# Altium schematic sheet Power.SchDoc
size A4
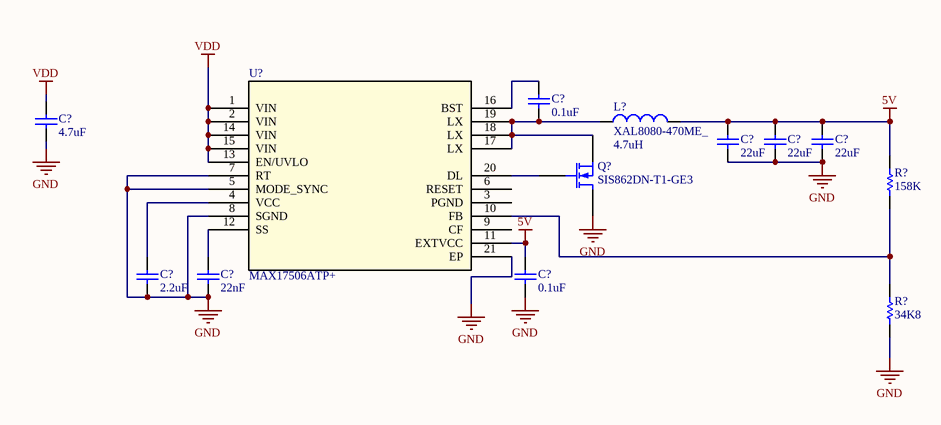
[diagram p0: Power.SchDoc]

## Parts
(Parts that share a designator on the sheet are numbered #1, #2 ... from top to bottom, then left to right.)
C?#1  value 0.1uF  [C0402[1005X55]]  (hidden comment: 0.1uF 16V 0402)
C?#2  value 4.7uF  [C1210[3225X200]]  (hidden comment: 4.7uF 100V 1210)
C?#3  value 22uF  [C1210[3225X250]]  (hidden comment: 22uF 16V 1210)
C?#4  value 22uF  [C1210[3225X250]]  (hidden comment: 22uF 16V 1210)
C?#5  value 22uF  [C1210[3225X250]]  (hidden comment: 22uF 16V 1210)
C?#6  value 2.2uF  [C0603[1608X92]]  (hidden comment: 2.2uF 10V 0603)
C?#7  value 22nF  [C0402[1005X55]]  (hidden comment: 22nF 50V 0402)
C?#8  value 0.1uF  [C0402[1005X55]]  (hidden comment: 0.1uF 6.3V 0402)
L?  XAL8080-470ME_  value 4.7uH  [XAL8080]
Q?  SIS862DN-T1-GE3  [PowerPak-1212-8]
R?#1  value 158K  [R0402[1005]]  (hidden comment: 158K 1% 0402)
R?#2  value 34K8  [R0402[1005]]  (hidden comment: 34K8 1% 0402)
U?  MAX17506ATP+  [21-0140L_T2055-4]

## Nets
5V: C?#3.2 C?#4.2 C?#5.2 C?#8.2 L?.2 R?#1.2 U?.11(EXTVCC)
GND: C?#2.1 C?#3.1 C?#4.1 C?#5.1 C?#6.1 C?#7.1 C?#8.1 Q?.3(D) R?#2.1 U?.5(MODE_SYNC) U?.7(RT) U?.8(SGND) U?.21(EP)
VDD: C?#2.2 U?.1(VIN) U?.2(VIN) U?.13(EN/UVLO) U?.14(VIN) U?.15(VIN)
NetC?#1_1: C?#1.1 L?.1 Q?.1(S) U?.17(LX) U?.18(LX) U?.19(LX)
NetC?#1_2: C?#1.2 U?.16(BST)
NetC?#6_2: C?#6.2 U?.4(VCC)
NetC?#7_2: C?#7.2 U?.12(SS)
NetQ?_2: Q?.2(G) U?.20(DL)
NetR?#1_1: R?#1.1 R?#2.2 U?.10(FB)

Not connected (* = marked no-connect by the designer): U? 3(PGND) 6(RESET) 9(CF)

## Library data of the parts
C?#1 = CAP_0.1uF_16V_0402_10%: 0.1uF 16V 10% 0402 (1005 Metric); PartNumber: GRM155R70J104KA01D; Manufacturer: Murata; Voltage: 6.3V; Mounting Technology: Surface Mount; PackageReference: 0402; PackageDescription: 0402 (1005 Metric); Tolerance: 10%
C?#2 = CAP_4.7uF_100V_1210_10%: 4.7uF 100V 10% 1210 (3225 Metric); PartNumber: GRJ32DC72A475KE11L; Manufacturer: Murata; Mounting Technology: Surface Mount; PackageReference: 1210; PackageDescription: 1210 (3225 Metric); Voltage: 100V; Tolerance: 10%
C?#3-C?#5 = CAP_22uF_16V_1210_20%_1: 22uF 16V 20% 1210 (3225 Metric); PartNumber: GRM32ER61C476ME15L; Manufacturer: Murata; Mounting Technology: Surface Mount; PackageReference: 1210; PackageDescription: 1210 (3225 Metric); Voltage: 16V; Tolerance: 20%
C?#6 = CAP_2.2uF_10V_0603_10%_1: 232uF 10V 10% 0603 (1608 Metric); PartNumber: GRT188R60J226ME13D; Manufacturer: Murata; Voltage: 6.3V; Mounting Technology: Surface Mount; PackageReference: 0603; PackageDescription: 0603 (1608 Metric); Tolerance: 10%
C?#7 = CAP_22nF_50V_0402_10%: 22nF 50V 10% 0402 (1005 Metric); PartNumber: GRM155R71H223KA12J; Manufacturer: Murata; Mounting Technology: Surface Mount; PackageReference: 0402; PackageDescription: 0402 (1005 Metric); Voltage: 50V; Tolerance: 10%
C?#8 = CAP_0.1uF_6.3V_0402_10%: 0.1uF 6.3V 10% 0402 (1005 Metric); PartNumber: GRM155R70J104KA01D; Manufacturer: Murata; Mounting Technology: Surface Mount; PackageReference: 0402; PackageDescription: 0402 (1005 Metric); Voltage: 6.3V; Tolerance: 10%
L? = XAL8080-470ME_: 4.7uH 38A 4.08mOhms; Code_IEC: 1005; Published: 8-Jun-2000; LatestRevisionDate: 29-May-2009; LatestRevisionNote: IPC-7351 Footprint Added.; PackageReference: 0402-A; Publisher: Altium Limited; PackageDescription: Chip Inductor; Code_JEITA: 0402
Q? = SIS862DN-T1-GE3: N-Channel MOSFET; Manufacturer: Vishay; PackageReference: PowerPAK-1212-8; PartNumber: SIS862DN-T1-GE3; Mounting Technology: Surface Mount
R?#1 = RES_158K_0402_1%: 158K 0.1W 1% 0402 (1005 Metric); Manufacturer: KOA Speer; PartNumber: RK73H1ETTP1502F; Power: 0.063W; Tolerance: 1%; Mounting Technology: Surface Mount; PackageReference: 0402; PackageDescription: 0402 (1005 Metric); ComponentLink1Description: Datasheet; ComponentLink1URL: http://www.koaspeer.com/catimages/Products/RK73H/RK73H.pdf
R?#2 = RES_34K8_0402_1%: 34K8 0.1W 1% 0402 (1005 Metric); Manufacturer: KOA Speer; PartNumber: RK73H1ETTP1502F; Power: 0.063W; Tolerance: 1%; Mounting Technology: Surface Mount; PackageReference: 0402; PackageDescription: 0402 (1005 Metric); ComponentLink1Description: Datasheet; ComponentLink1URL: http://www.koaspeer.com/catimages/Products/RK73H/RK73H.pdf
U? = MAX17506ATP+: Manufacturer_Part_Number: max6795tpzd3+t; Vendor: MAXIM; Value: Value; Type: Type; RefDes: RefDes